# EAGLE schematic v6 (EAGLE 9.6.2)
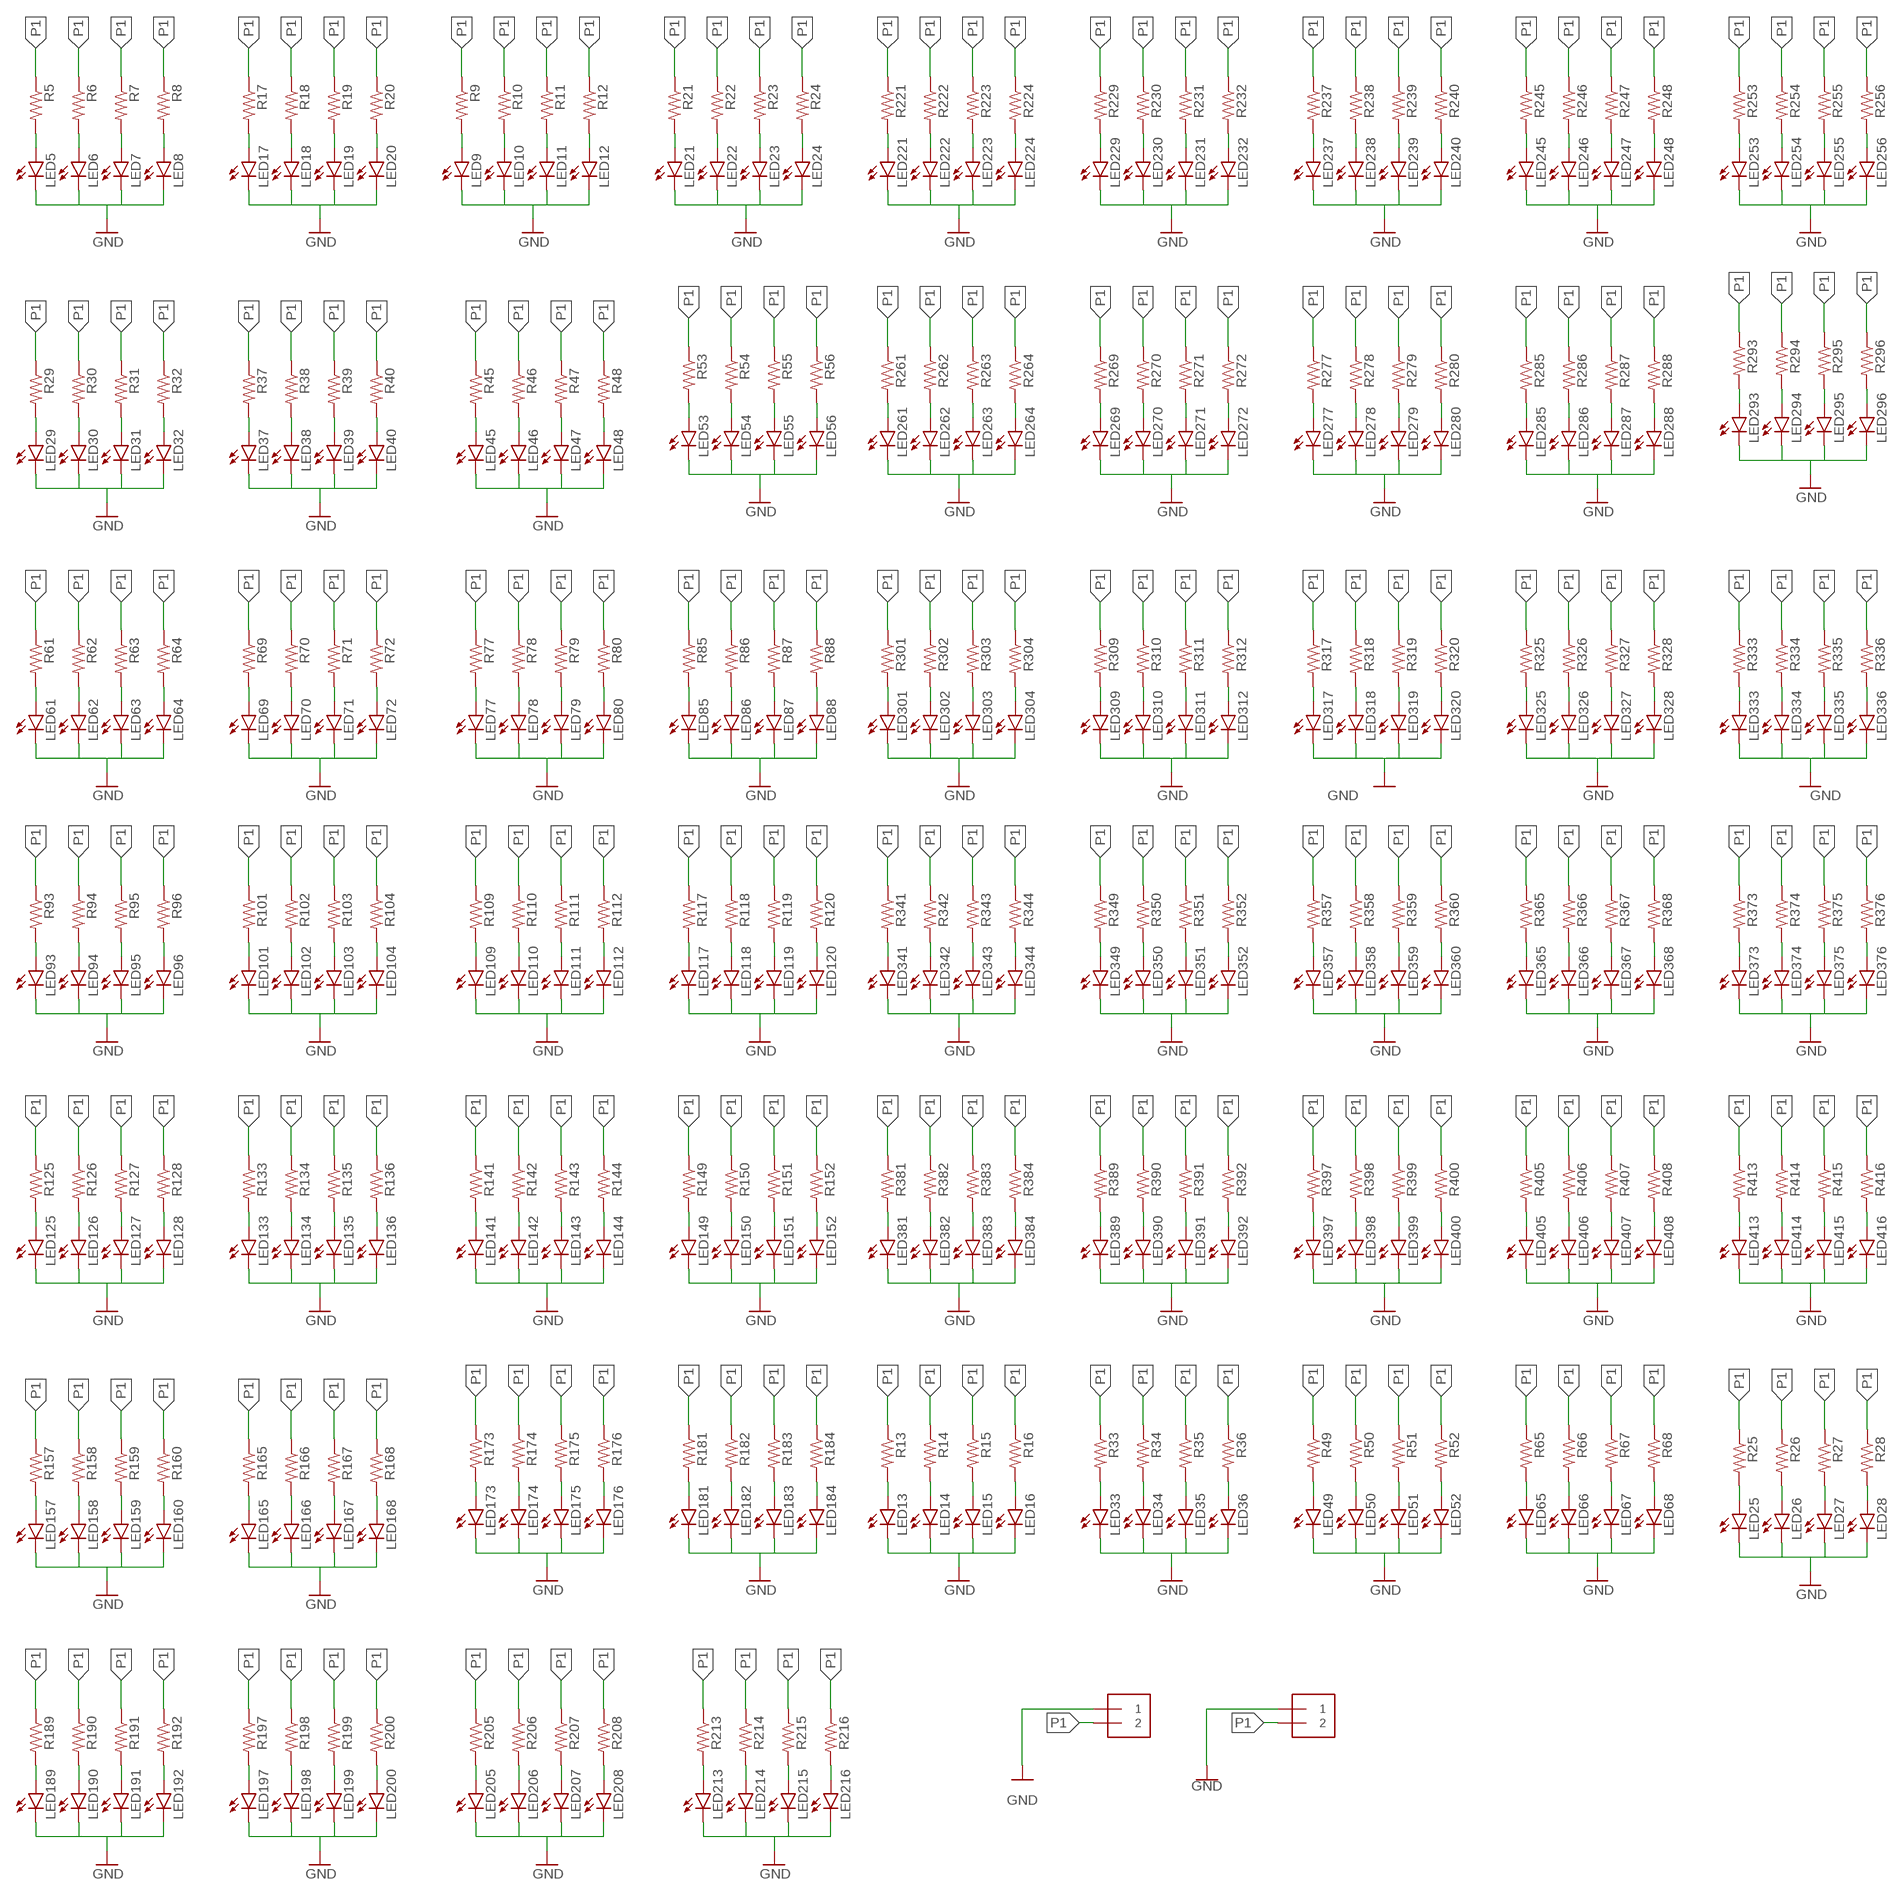
[diagram p0: schematic, sheet 1]

## Parts
LED5  LEDCHIP-LED0603  [CHIP-LED0603]
LED6  LEDCHIP-LED0603  [CHIP-LED0603]
LED7  LEDCHIP-LED0603  [CHIP-LED0603]
LED8  LEDCHIP-LED0603  [CHIP-LED0603]
LED9  LEDCHIP-LED0603  [CHIP-LED0603]
LED10  LEDCHIP-LED0603  [CHIP-LED0603]
LED11  LEDCHIP-LED0603  [CHIP-LED0603]
LED12  LEDCHIP-LED0603  [CHIP-LED0603]
LED13  LEDCHIP-LED0603  [CHIP-LED0603]
LED14  LEDCHIP-LED0603  [CHIP-LED0603]
LED15  LEDCHIP-LED0603  [CHIP-LED0603]
LED16  LEDCHIP-LED0603  [CHIP-LED0603]
LED17  LEDCHIP-LED0603  [CHIP-LED0603]
LED18  LEDCHIP-LED0603  [CHIP-LED0603]
LED19  LEDCHIP-LED0603  [CHIP-LED0603]
LED20  LEDCHIP-LED0603  [CHIP-LED0603]
LED21  LEDCHIP-LED0603  [CHIP-LED0603]
LED22  LEDCHIP-LED0603  [CHIP-LED0603]
LED23  LEDCHIP-LED0603  [CHIP-LED0603]
LED24  LEDCHIP-LED0603  [CHIP-LED0603]
LED25  LEDCHIP-LED0603  [CHIP-LED0603]
LED26  LEDCHIP-LED0603  [CHIP-LED0603]
LED27  LEDCHIP-LED0603  [CHIP-LED0603]
LED28  LEDCHIP-LED0603  [CHIP-LED0603]
LED29  LEDCHIP-LED0603  [CHIP-LED0603]
LED30  LEDCHIP-LED0603  [CHIP-LED0603]
LED31  LEDCHIP-LED0603  [CHIP-LED0603]
LED32  LEDCHIP-LED0603  [CHIP-LED0603]
LED33  LEDCHIP-LED0603  [CHIP-LED0603]
LED34  LEDCHIP-LED0603  [CHIP-LED0603]
LED35  LEDCHIP-LED0603  [CHIP-LED0603]
LED36  LEDCHIP-LED0603  [CHIP-LED0603]
LED37  LEDCHIP-LED0603  [CHIP-LED0603]
LED38  LEDCHIP-LED0603  [CHIP-LED0603]
LED39  LEDCHIP-LED0603  [CHIP-LED0603]
LED40  LEDCHIP-LED0603  [CHIP-LED0603]
LED45  LEDCHIP-LED0603  [CHIP-LED0603]
LED46  LEDCHIP-LED0603  [CHIP-LED0603]
LED47  LEDCHIP-LED0603  [CHIP-LED0603]
LED48  LEDCHIP-LED0603  [CHIP-LED0603]
LED49  LEDCHIP-LED0603  [CHIP-LED0603]
LED50  LEDCHIP-LED0603  [CHIP-LED0603]
LED51  LEDCHIP-LED0603  [CHIP-LED0603]
LED52  LEDCHIP-LED0603  [CHIP-LED0603]
LED53  LEDCHIP-LED0603  [CHIP-LED0603]
LED54  LEDCHIP-LED0603  [CHIP-LED0603]
LED55  LEDCHIP-LED0603  [CHIP-LED0603]
LED56  LEDCHIP-LED0603  [CHIP-LED0603]
LED61  LEDCHIP-LED0603  [CHIP-LED0603]
LED62  LEDCHIP-LED0603  [CHIP-LED0603]
LED63  LEDCHIP-LED0603  [CHIP-LED0603]
LED64  LEDCHIP-LED0603  [CHIP-LED0603]
LED65  LEDCHIP-LED0603  [CHIP-LED0603]
LED66  LEDCHIP-LED0603  [CHIP-LED0603]
LED67  LEDCHIP-LED0603  [CHIP-LED0603]
LED68  LEDCHIP-LED0603  [CHIP-LED0603]
LED69  LEDCHIP-LED0603  [CHIP-LED0603]
LED70  LEDCHIP-LED0603  [CHIP-LED0603]
LED71  LEDCHIP-LED0603  [CHIP-LED0603]
LED72  LEDCHIP-LED0603  [CHIP-LED0603]
LED77  LEDCHIP-LED0603  [CHIP-LED0603]
LED78  LEDCHIP-LED0603  [CHIP-LED0603]
LED79  LEDCHIP-LED0603  [CHIP-LED0603]
LED80  LEDCHIP-LED0603  [CHIP-LED0603]
LED85  LEDCHIP-LED0603  [CHIP-LED0603]
LED86  LEDCHIP-LED0603  [CHIP-LED0603]
LED87  LEDCHIP-LED0603  [CHIP-LED0603]
LED88  LEDCHIP-LED0603  [CHIP-LED0603]
LED93  LEDCHIP-LED0603  [CHIP-LED0603]
LED94  LEDCHIP-LED0603  [CHIP-LED0603]
LED95  LEDCHIP-LED0603  [CHIP-LED0603]
LED96  LEDCHIP-LED0603  [CHIP-LED0603]
LED101  LEDCHIP-LED0603  [CHIP-LED0603]
LED102  LEDCHIP-LED0603  [CHIP-LED0603]
LED103  LEDCHIP-LED0603  [CHIP-LED0603]
LED104  LEDCHIP-LED0603  [CHIP-LED0603]
LED109  LEDCHIP-LED0603  [CHIP-LED0603]
LED110  LEDCHIP-LED0603  [CHIP-LED0603]
LED111  LEDCHIP-LED0603  [CHIP-LED0603]
LED112  LEDCHIP-LED0603  [CHIP-LED0603]
LED117  LEDCHIP-LED0603  [CHIP-LED0603]
LED118  LEDCHIP-LED0603  [CHIP-LED0603]
LED119  LEDCHIP-LED0603  [CHIP-LED0603]
LED120  LEDCHIP-LED0603  [CHIP-LED0603]
LED125  LEDCHIP-LED0603  [CHIP-LED0603]
LED126  LEDCHIP-LED0603  [CHIP-LED0603]
LED127  LEDCHIP-LED0603  [CHIP-LED0603]
LED128  LEDCHIP-LED0603  [CHIP-LED0603]
LED133  LEDCHIP-LED0603  [CHIP-LED0603]
LED134  LEDCHIP-LED0603  [CHIP-LED0603]
LED135  LEDCHIP-LED0603  [CHIP-LED0603]
LED136  LEDCHIP-LED0603  [CHIP-LED0603]
LED141  LEDCHIP-LED0603  [CHIP-LED0603]
LED142  LEDCHIP-LED0603  [CHIP-LED0603]
LED143  LEDCHIP-LED0603  [CHIP-LED0603]
LED144  LEDCHIP-LED0603  [CHIP-LED0603]
LED149  LEDCHIP-LED0603  [CHIP-LED0603]
LED150  LEDCHIP-LED0603  [CHIP-LED0603]
LED151  LEDCHIP-LED0603  [CHIP-LED0603]
LED152  LEDCHIP-LED0603  [CHIP-LED0603]
LED157  LEDCHIP-LED0603  [CHIP-LED0603]
LED158  LEDCHIP-LED0603  [CHIP-LED0603]
LED159  LEDCHIP-LED0603  [CHIP-LED0603]
LED160  LEDCHIP-LED0603  [CHIP-LED0603]
LED165  LEDCHIP-LED0603  [CHIP-LED0603]
LED166  LEDCHIP-LED0603  [CHIP-LED0603]
LED167  LEDCHIP-LED0603  [CHIP-LED0603]
LED168  LEDCHIP-LED0603  [CHIP-LED0603]
LED173  LEDCHIP-LED0603  [CHIP-LED0603]
LED174  LEDCHIP-LED0603  [CHIP-LED0603]
LED175  LEDCHIP-LED0603  [CHIP-LED0603]
LED176  LEDCHIP-LED0603  [CHIP-LED0603]
LED181  LEDCHIP-LED0603  [CHIP-LED0603]
LED182  LEDCHIP-LED0603  [CHIP-LED0603]
LED183  LEDCHIP-LED0603  [CHIP-LED0603]
LED184  LEDCHIP-LED0603  [CHIP-LED0603]
LED189  LEDCHIP-LED0603  [CHIP-LED0603]
LED190  LEDCHIP-LED0603  [CHIP-LED0603]
LED191  LEDCHIP-LED0603  [CHIP-LED0603]
LED192  LEDCHIP-LED0603  [CHIP-LED0603]
LED197  LEDCHIP-LED0603  [CHIP-LED0603]
LED198  LEDCHIP-LED0603  [CHIP-LED0603]
LED199  LEDCHIP-LED0603  [CHIP-LED0603]
LED200  LEDCHIP-LED0603  [CHIP-LED0603]
LED205  LEDCHIP-LED0603  [CHIP-LED0603]
LED206  LEDCHIP-LED0603  [CHIP-LED0603]
LED207  LEDCHIP-LED0603  [CHIP-LED0603]
LED208  LEDCHIP-LED0603  [CHIP-LED0603]
LED213  LEDCHIP-LED0603  [CHIP-LED0603]
LED214  LEDCHIP-LED0603  [CHIP-LED0603]
LED215  LEDCHIP-LED0603  [CHIP-LED0603]
LED216  LEDCHIP-LED0603  [CHIP-LED0603]
LED221  LEDCHIP-LED0603  [CHIP-LED0603]
LED222  LEDCHIP-LED0603  [CHIP-LED0603]
LED223  LEDCHIP-LED0603  [CHIP-LED0603]
LED224  LEDCHIP-LED0603  [CHIP-LED0603]
LED229  LEDCHIP-LED0603  [CHIP-LED0603]
LED230  LEDCHIP-LED0603  [CHIP-LED0603]
LED231  LEDCHIP-LED0603  [CHIP-LED0603]
LED232  LEDCHIP-LED0603  [CHIP-LED0603]
LED237  LEDCHIP-LED0603  [CHIP-LED0603]
LED238  LEDCHIP-LED0603  [CHIP-LED0603]
LED239  LEDCHIP-LED0603  [CHIP-LED0603]
LED240  LEDCHIP-LED0603  [CHIP-LED0603]
LED245  LEDCHIP-LED0603  [CHIP-LED0603]
LED246  LEDCHIP-LED0603  [CHIP-LED0603]
LED247  LEDCHIP-LED0603  [CHIP-LED0603]
LED248  LEDCHIP-LED0603  [CHIP-LED0603]
LED253  LEDCHIP-LED0603  [CHIP-LED0603]
LED254  LEDCHIP-LED0603  [CHIP-LED0603]
LED255  LEDCHIP-LED0603  [CHIP-LED0603]
LED256  LEDCHIP-LED0603  [CHIP-LED0603]
LED261  LEDCHIP-LED0603  [CHIP-LED0603]
LED262  LEDCHIP-LED0603  [CHIP-LED0603]
LED263  LEDCHIP-LED0603  [CHIP-LED0603]
LED264  LEDCHIP-LED0603  [CHIP-LED0603]
LED269  LEDCHIP-LED0603  [CHIP-LED0603]
LED270  LEDCHIP-LED0603  [CHIP-LED0603]
LED271  LEDCHIP-LED0603  [CHIP-LED0603]
LED272  LEDCHIP-LED0603  [CHIP-LED0603]
LED277  LEDCHIP-LED0603  [CHIP-LED0603]
LED278  LEDCHIP-LED0603  [CHIP-LED0603]
LED279  LEDCHIP-LED0603  [CHIP-LED0603]
LED280  LEDCHIP-LED0603  [CHIP-LED0603]
LED285  LEDCHIP-LED0603  [CHIP-LED0603]
LED286  LEDCHIP-LED0603  [CHIP-LED0603]
LED287  LEDCHIP-LED0603  [CHIP-LED0603]
LED288  LEDCHIP-LED0603  [CHIP-LED0603]
LED293  LEDCHIP-LED0603  [CHIP-LED0603]
LED294  LEDCHIP-LED0603  [CHIP-LED0603]
LED295  LEDCHIP-LED0603  [CHIP-LED0603]
LED296  LEDCHIP-LED0603  [CHIP-LED0603]
LED301  LEDCHIP-LED0603  [CHIP-LED0603]
LED302  LEDCHIP-LED0603  [CHIP-LED0603]
LED303  LEDCHIP-LED0603  [CHIP-LED0603]
LED304  LEDCHIP-LED0603  [CHIP-LED0603]
LED309  LEDCHIP-LED0603  [CHIP-LED0603]
LED310  LEDCHIP-LED0603  [CHIP-LED0603]
LED311  LEDCHIP-LED0603  [CHIP-LED0603]
LED312  LEDCHIP-LED0603  [CHIP-LED0603]
LED317  LEDCHIP-LED0603  [CHIP-LED0603]
LED318  LEDCHIP-LED0603  [CHIP-LED0603]
LED319  LEDCHIP-LED0603  [CHIP-LED0603]
LED320  LEDCHIP-LED0603  [CHIP-LED0603]
LED325  LEDCHIP-LED0603  [CHIP-LED0603]
LED326  LEDCHIP-LED0603  [CHIP-LED0603]
LED327  LEDCHIP-LED0603  [CHIP-LED0603]
LED328  LEDCHIP-LED0603  [CHIP-LED0603]
LED333  LEDCHIP-LED0603  [CHIP-LED0603]
LED334  LEDCHIP-LED0603  [CHIP-LED0603]
LED335  LEDCHIP-LED0603  [CHIP-LED0603]
LED336  LEDCHIP-LED0603  [CHIP-LED0603]
LED341  LEDCHIP-LED0603  [CHIP-LED0603]
LED342  LEDCHIP-LED0603  [CHIP-LED0603]
LED343  LEDCHIP-LED0603  [CHIP-LED0603]
LED344  LEDCHIP-LED0603  [CHIP-LED0603]
LED349  LEDCHIP-LED0603  [CHIP-LED0603]
LED350  LEDCHIP-LED0603  [CHIP-LED0603]
LED351  LEDCHIP-LED0603  [CHIP-LED0603]
LED352  LEDCHIP-LED0603  [CHIP-LED0603]
LED357  LEDCHIP-LED0603  [CHIP-LED0603]
LED358  LEDCHIP-LED0603  [CHIP-LED0603]
LED359  LEDCHIP-LED0603  [CHIP-LED0603]
LED360  LEDCHIP-LED0603  [CHIP-LED0603]
LED365  LEDCHIP-LED0603  [CHIP-LED0603]
LED366  LEDCHIP-LED0603  [CHIP-LED0603]
LED367  LEDCHIP-LED0603  [CHIP-LED0603]
LED368  LEDCHIP-LED0603  [CHIP-LED0603]
LED373  LEDCHIP-LED0603  [CHIP-LED0603]
LED374  LEDCHIP-LED0603  [CHIP-LED0603]
LED375  LEDCHIP-LED0603  [CHIP-LED0603]
LED376  LEDCHIP-LED0603  [CHIP-LED0603]
LED381  LEDCHIP-LED0603  [CHIP-LED0603]
LED382  LEDCHIP-LED0603  [CHIP-LED0603]
LED383  LEDCHIP-LED0603  [CHIP-LED0603]
LED384  LEDCHIP-LED0603  [CHIP-LED0603]
LED389  LEDCHIP-LED0603  [CHIP-LED0603]
LED390  LEDCHIP-LED0603  [CHIP-LED0603]
LED391  LEDCHIP-LED0603  [CHIP-LED0603]
LED392  LEDCHIP-LED0603  [CHIP-LED0603]
LED397  LEDCHIP-LED0603  [CHIP-LED0603]
LED398  LEDCHIP-LED0603  [CHIP-LED0603]
LED399  LEDCHIP-LED0603  [CHIP-LED0603]
LED400  LEDCHIP-LED0603  [CHIP-LED0603]
LED405  LEDCHIP-LED0603  [CHIP-LED0603]
LED406  LEDCHIP-LED0603  [CHIP-LED0603]
LED407  LEDCHIP-LED0603  [CHIP-LED0603]
LED408  LEDCHIP-LED0603  [CHIP-LED0603]
LED413  LEDCHIP-LED0603  [CHIP-LED0603]
LED414  LEDCHIP-LED0603  [CHIP-LED0603]
LED415  LEDCHIP-LED0603  [CHIP-LED0603]
LED416  LEDCHIP-LED0603  [CHIP-LED0603]
R5  R-US_R0603  [R0603]
R6  R-US_R0603  [R0603]
R7  R-US_R0603  [R0603]
R8  R-US_R0603  [R0603]
R9  R-US_R0603  [R0603]
R10  R-US_R0603  [R0603]
R11  R-US_R0603  [R0603]
R12  R-US_R0603  [R0603]
R13  R-US_R0603  [R0603]
R14  R-US_R0603  [R0603]
R15  R-US_R0603  [R0603]
R16  R-US_R0603  [R0603]
R17  R-US_R0603  [R0603]
R18  R-US_R0603  [R0603]
R19  R-US_R0603  [R0603]
R20  R-US_R0603  [R0603]
R21  R-US_R0603  [R0603]
R22  R-US_R0603  [R0603]
R23  R-US_R0603  [R0603]
R24  R-US_R0603  [R0603]
R25  R-US_R0603  [R0603]
R26  R-US_R0603  [R0603]
R27  R-US_R0603  [R0603]
R28  R-US_R0603  [R0603]
R29  R-US_R0603  [R0603]
R30  R-US_R0603  [R0603]
R31  R-US_R0603  [R0603]
R32  R-US_R0603  [R0603]
R33  R-US_R0603  [R0603]
R34  R-US_R0603  [R0603]
R35  R-US_R0603  [R0603]
R36  R-US_R0603  [R0603]
R37  R-US_R0603  [R0603]
R38  R-US_R0603  [R0603]
R39  R-US_R0603  [R0603]
R40  R-US_R0603  [R0603]
R45  R-US_R0603  [R0603]
R46  R-US_R0603  [R0603]
R47  R-US_R0603  [R0603]
R48  R-US_R0603  [R0603]
R49  R-US_R0603  [R0603]
R50  R-US_R0603  [R0603]
R51  R-US_R0603  [R0603]
R52  R-US_R0603  [R0603]
R53  R-US_R0603  [R0603]
R54  R-US_R0603  [R0603]
R55  R-US_R0603  [R0603]
R56  R-US_R0603  [R0603]
R61  R-US_R0603  [R0603]
R62  R-US_R0603  [R0603]
R63  R-US_R0603  [R0603]
R64  R-US_R0603  [R0603]
R65  R-US_R0603  [R0603]
R66  R-US_R0603  [R0603]
R67  R-US_R0603  [R0603]
R68  R-US_R0603  [R0603]
R69  R-US_R0603  [R0603]
R70  R-US_R0603  [R0603]
R71  R-US_R0603  [R0603]
R72  R-US_R0603  [R0603]
R77  R-US_R0603  [R0603]
R78  R-US_R0603  [R0603]
R79  R-US_R0603  [R0603]
R80  R-US_R0603  [R0603]
R85  R-US_R0603  [R0603]
R86  R-US_R0603  [R0603]
R87  R-US_R0603  [R0603]
R88  R-US_R0603  [R0603]
R93  R-US_R0603  [R0603]
R94  R-US_R0603  [R0603]
R95  R-US_R0603  [R0603]
R96  R-US_R0603  [R0603]
R101  R-US_R0603  [R0603]
R102  R-US_R0603  [R0603]
R103  R-US_R0603  [R0603]
R104  R-US_R0603  [R0603]
R109  R-US_R0603  [R0603]
R110  R-US_R0603  [R0603]
R111  R-US_R0603  [R0603]
R112  R-US_R0603  [R0603]
R117  R-US_R0603  [R0603]
R118  R-US_R0603  [R0603]
R119  R-US_R0603  [R0603]
R120  R-US_R0603  [R0603]
R125  R-US_R0603  [R0603]
R126  R-US_R0603  [R0603]
R127  R-US_R0603  [R0603]
R128  R-US_R0603  [R0603]
R133  R-US_R0603  [R0603]
R134  R-US_R0603  [R0603]
R135  R-US_R0603  [R0603]
R136  R-US_R0603  [R0603]
R141  R-US_R0603  [R0603]
R142  R-US_R0603  [R0603]
R143  R-US_R0603  [R0603]
R144  R-US_R0603  [R0603]
R149  R-US_R0603  [R0603]
R150  R-US_R0603  [R0603]
R151  R-US_R0603  [R0603]
R152  R-US_R0603  [R0603]
R157  R-US_R0603  [R0603]
R158  R-US_R0603  [R0603]
R159  R-US_R0603  [R0603]
R160  R-US_R0603  [R0603]
R165  R-US_R0603  [R0603]
R166  R-US_R0603  [R0603]
R167  R-US_R0603  [R0603]
R168  R-US_R0603  [R0603]
R173  R-US_R0603  [R0603]
R174  R-US_R0603  [R0603]
R175  R-US_R0603  [R0603]
R176  R-US_R0603  [R0603]
R181  R-US_R0603  [R0603]
R182  R-US_R0603  [R0603]
R183  R-US_R0603  [R0603]
R184  R-US_R0603  [R0603]
R189  R-US_R0603  [R0603]
R190  R-US_R0603  [R0603]
R191  R-US_R0603  [R0603]
R192  R-US_R0603  [R0603]
R197  R-US_R0603  [R0603]
R198  R-US_R0603  [R0603]
R199  R-US_R0603  [R0603]
R200  R-US_R0603  [R0603]
R205  R-US_R0603  [R0603]
R206  R-US_R0603  [R0603]
R207  R-US_R0603  [R0603]
R208  R-US_R0603  [R0603]
R213  R-US_R0603  [R0603]
R214  R-US_R0603  [R0603]
R215  R-US_R0603  [R0603]
R216  R-US_R0603  [R0603]
R221  R-US_R0603  [R0603]
R222  R-US_R0603  [R0603]
R223  R-US_R0603  [R0603]
R224  R-US_R0603  [R0603]
R229  R-US_R0603  [R0603]
R230  R-US_R0603  [R0603]
R231  R-US_R0603  [R0603]
R232  R-US_R0603  [R0603]
R237  R-US_R0603  [R0603]
R238  R-US_R0603  [R0603]
R239  R-US_R0603  [R0603]
R240  R-US_R0603  [R0603]
R245  R-US_R0603  [R0603]
R246  R-US_R0603  [R0603]
R247  R-US_R0603  [R0603]
R248  R-US_R0603  [R0603]
R253  R-US_R0603  [R0603]
R254  R-US_R0603  [R0603]
R255  R-US_R0603  [R0603]
R256  R-US_R0603  [R0603]
R261  R-US_R0603  [R0603]
R262  R-US_R0603  [R0603]
R263  R-US_R0603  [R0603]
R264  R-US_R0603  [R0603]
R269  R-US_R0603  [R0603]
R270  R-US_R0603  [R0603]
R271  R-US_R0603  [R0603]
R272  R-US_R0603  [R0603]
R277  R-US_R0603  [R0603]
R278  R-US_R0603  [R0603]
R279  R-US_R0603  [R0603]
R280  R-US_R0603  [R0603]
R285  R-US_R0603  [R0603]
R286  R-US_R0603  [R0603]
R287  R-US_R0603  [R0603]
R288  R-US_R0603  [R0603]
R293  R-US_R0603  [R0603]
R294  R-US_R0603  [R0603]
R295  R-US_R0603  [R0603]
R296  R-US_R0603  [R0603]
R301  R-US_R0603  [R0603]
R302  R-US_R0603  [R0603]
R303  R-US_R0603  [R0603]
R304  R-US_R0603  [R0603]
R309  R-US_R0603  [R0603]
R310  R-US_R0603  [R0603]
R311  R-US_R0603  [R0603]
R312  R-US_R0603  [R0603]
R317  R-US_R0603  [R0603]
R318  R-US_R0603  [R0603]
R319  R-US_R0603  [R0603]
R320  R-US_R0603  [R0603]
R325  R-US_R0603  [R0603]
R326  R-US_R0603  [R0603]
R327  R-US_R0603  [R0603]
R328  R-US_R0603  [R0603]
R333  R-US_R0603  [R0603]
R334  R-US_R0603  [R0603]
R335  R-US_R0603  [R0603]
R336  R-US_R0603  [R0603]
R341  R-US_R0603  [R0603]
R342  R-US_R0603  [R0603]
R343  R-US_R0603  [R0603]
R344  R-US_R0603  [R0603]
R349  R-US_R0603  [R0603]
R350  R-US_R0603  [R0603]
R351  R-US_R0603  [R0603]
R352  R-US_R0603  [R0603]
R357  R-US_R0603  [R0603]
R358  R-US_R0603  [R0603]
R359  R-US_R0603  [R0603]
R360  R-US_R0603  [R0603]
R365  R-US_R0603  [R0603]
R366  R-US_R0603  [R0603]
R367  R-US_R0603  [R0603]
R368  R-US_R0603  [R0603]
R373  R-US_R0603  [R0603]
R374  R-US_R0603  [R0603]
R375  R-US_R0603  [R0603]
R376  R-US_R0603  [R0603]
R381  R-US_R0603  [R0603]
R382  R-US_R0603  [R0603]
R383  R-US_R0603  [R0603]
R384  R-US_R0603  [R0603]
R389  R-US_R0603  [R0603]
R390  R-US_R0603  [R0603]
R391  R-US_R0603  [R0603]
R392  R-US_R0603  [R0603]
R397  R-US_R0603  [R0603]
R398  R-US_R0603  [R0603]
R399  R-US_R0603  [R0603]
R400  R-US_R0603  [R0603]
R405  R-US_R0603  [R0603]
R406  R-US_R0603  [R0603]
R407  R-US_R0603  [R0603]
R408  R-US_R0603  [R0603]
R413  R-US_R0603  [R0603]
R414  R-US_R0603  [R0603]
R415  R-US_R0603  [R0603]
R416  R-US_R0603  [R0603]
U$1  MOLEX_0039301022  [MINI-FIT_JR_CONN]
U$2  MOLEX_0039301022  [MINI-FIT_JR_CONN]

## Nets
GNDSSS: LED5.C LED6.C LED7.C LED8.C LED9.C LED10.C LED11.C LED12.C LED13.C LED14.C LED15.C LED16.C LED17.C LED18.C LED19.C LED20.C LED21.C LED22.C LED23.C LED24.C LED25.C LED26.C LED27.C LED28.C LED29.C LED30.C LED31.C LED32.C LED33.C LED34.C LED35.C LED36.C LED37.C LED38.C LED39.C LED40.C LED45.C LED46.C LED47.C LED48.C LED49.C LED50.C LED51.C LED52.C LED53.C LED54.C LED55.C LED56.C LED61.C LED62.C LED63.C LED64.C LED65.C LED66.C LED67.C LED68.C LED69.C LED70.C LED71.C LED72.C LED77.C LED78.C LED79.C LED80.C LED85.C LED86.C LED87.C LED88.C LED93.C LED94.C LED95.C LED96.C LED101.C LED102.C LED103.C LED104.C LED109.C LED110.C LED111.C LED112.C LED117.C LED118.C LED119.C LED120.C LED125.C LED126.C LED127.C LED128.C LED133.C LED134.C LED135.C LED136.C LED141.C LED142.C LED143.C LED144.C LED149.C LED150.C LED151.C LED152.C LED157.C LED158.C LED159.C LED160.C LED165.C LED166.C LED167.C LED168.C LED173.C LED174.C LED175.C LED176.C LED181.C LED182.C LED183.C LED184.C LED189.C LED190.C LED191.C LED192.C LED197.C LED198.C LED199.C LED200.C LED205.C LED206.C LED207.C LED208.C LED213.C LED214.C LED215.C LED216.C LED221.C LED222.C LED223.C LED224.C LED229.C LED230.C LED231.C LED232.C LED237.C LED238.C LED239.C LED240.C LED245.C LED246.C LED247.C LED248.C LED253.C LED254.C LED255.C LED256.C LED261.C LED262.C LED263.C LED264.C LED269.C LED270.C LED271.C LED272.C LED277.C LED278.C LED279.C LED280.C LED285.C LED286.C LED287.C LED288.C LED293.C LED294.C LED295.C LED296.C LED301.C LED302.C LED303.C LED304.C LED309.C LED310.C LED311.C LED312.C LED317.C LED318.C LED319.C LED320.C LED325.C LED326.C LED327.C LED328.C LED333.C LED334.C LED335.C LED336.C LED341.C LED342.C LED343.C LED344.C LED349.C LED350.C LED351.C LED352.C LED357.C LED358.C LED359.C LED360.C LED365.C LED366.C LED367.C LED368.C LED373.C LED374.C LED375.C LED376.C LED381.C LED382.C LED383.C LED384.C LED389.C LED390.C LED391.C LED392.C LED397.C LED398.C LED399.C LED400.C LED405.C LED406.C LED407.C LED408.C LED413.C LED414.C LED415.C LED416.C U$1.P$2 U$2.P$2 ; supply symbol labelled GND
N$1: LED5.A R5.2
N$2: LED6.A R6.2
N$3: LED7.A R7.2
N$4: LED8.A R8.2
N$5: LED9.A R9.2
N$6: LED10.A R10.2
N$7: LED11.A R11.2
N$8: LED12.A R12.2
N$9: LED13.A R13.2
N$10: LED14.A R14.2
N$11: LED15.A R15.2
N$12: LED16.A R16.2
N$13: LED17.A R17.2
N$14: LED18.A R18.2
N$15: LED19.A R19.2
N$16: LED20.A R20.2
N$17: LED21.A R21.2
N$18: LED22.A R22.2
N$19: LED23.A R23.2
N$20: LED24.A R24.2
N$21: LED25.A R25.2
N$22: LED26.A R26.2
N$23: LED27.A R27.2
N$24: LED28.A R28.2
N$29: LED29.A R29.2
N$30: LED30.A R30.2
N$31: LED31.A R31.2
N$32: LED32.A R32.2
N$33: LED33.A R33.2
N$34: LED34.A R34.2
N$35: LED35.A R35.2
N$36: LED36.A R36.2
N$37: LED37.A R37.2
N$38: LED38.A R38.2
N$39: LED39.A R39.2
N$40: LED40.A R40.2
N$45: LED45.A R45.2
N$46: LED46.A R46.2
N$47: LED47.A R47.2
N$48: LED48.A R48.2
N$49: LED49.A R49.2
N$50: LED50.A R50.2
N$51: LED51.A R51.2
N$52: LED52.A R52.2
N$53: LED53.A R53.2
N$54: LED54.A R54.2
N$55: LED55.A R55.2
N$56: LED56.A R56.2
N$61: LED61.A R61.2
N$62: LED62.A R62.2
N$63: LED63.A R63.2
N$64: LED64.A R64.2
N$65: LED65.A R65.2
N$66: LED66.A R66.2
N$67: LED67.A R67.2
N$68: LED68.A R68.2
N$69: LED69.A R69.2
N$70: LED70.A R70.2
N$71: LED71.A R71.2
N$72: LED72.A R72.2
N$77: LED77.A R77.2
N$78: LED78.A R78.2
N$79: LED79.A R79.2
N$80: LED80.A R80.2
N$85: LED85.A R85.2
N$86: LED86.A R86.2
N$87: LED87.A R87.2
N$88: LED88.A R88.2
N$93: LED93.A R93.2
N$94: LED94.A R94.2
N$95: LED95.A R95.2
N$96: LED96.A R96.2
N$101: LED101.A R101.2
N$102: LED102.A R102.2
N$103: LED103.A R103.2
N$104: LED104.A R104.2
N$109: LED109.A R109.2
N$110: LED110.A R110.2
N$111: LED111.A R111.2
N$112: LED112.A R112.2
N$117: LED117.A R117.2
N$118: LED118.A R118.2
N$119: LED119.A R119.2
N$120: LED120.A R120.2
N$125: LED125.A R125.2
N$126: LED126.A R126.2
N$127: LED127.A R127.2
N$128: LED128.A R128.2
N$133: LED133.A R133.2
N$134: LED134.A R134.2
N$135: LED135.A R135.2
N$136: LED136.A R136.2
N$141: LED141.A R141.2
N$142: LED142.A R142.2
N$143: LED143.A R143.2
N$144: LED144.A R144.2
N$149: LED149.A R149.2
N$150: LED150.A R150.2
N$151: LED151.A R151.2
N$152: LED152.A R152.2
N$157: LED157.A R157.2
N$158: LED158.A R158.2
N$159: LED159.A R159.2
N$160: LED160.A R160.2
N$165: LED165.A R165.2
N$166: LED166.A R166.2
N$167: LED167.A R167.2
N$168: LED168.A R168.2
N$173: LED173.A R173.2
N$174: LED174.A R174.2
N$175: LED175.A R175.2
N$176: LED176.A R176.2
N$181: LED181.A R181.2
N$182: LED182.A R182.2
N$183: LED183.A R183.2
N$184: LED184.A R184.2
N$189: LED189.A R189.2
N$190: LED190.A R190.2
N$191: LED191.A R191.2
N$192: LED192.A R192.2
N$197: LED197.A R197.2
N$198: LED198.A R198.2
N$199: LED199.A R199.2
N$200: LED200.A R200.2
N$205: LED205.A R205.2
N$206: LED206.A R206.2
N$207: LED207.A R207.2
N$208: LED208.A R208.2
N$213: LED213.A R213.2
N$214: LED214.A R214.2
N$215: LED215.A R215.2
N$216: LED216.A R216.2
N$221: LED221.A R221.2
N$222: LED222.A R222.2
N$223: LED223.A R223.2
N$224: LED224.A R224.2
N$229: LED229.A R229.2
N$230: LED230.A R230.2
N$231: LED231.A R231.2
N$232: LED232.A R232.2
N$237: LED237.A R237.2
N$238: LED238.A R238.2
N$239: LED239.A R239.2
N$240: LED240.A R240.2
N$245: LED245.A R245.2
N$246: LED246.A R246.2
N$247: LED247.A R247.2
N$248: LED248.A R248.2
N$253: LED253.A R253.2
N$254: LED254.A R254.2
N$255: LED255.A R255.2
N$256: LED256.A R256.2
N$261: LED261.A R261.2
N$262: LED262.A R262.2
N$263: LED263.A R263.2
N$264: LED264.A R264.2
N$269: LED269.A R269.2
N$270: LED270.A R270.2
N$271: LED271.A R271.2
N$272: LED272.A R272.2
N$277: LED277.A R277.2
N$278: LED278.A R278.2
N$279: LED279.A R279.2
N$280: LED280.A R280.2
N$285: LED285.A R285.2
N$286: LED286.A R286.2
N$287: LED287.A R287.2
N$288: LED288.A R288.2
N$293: LED293.A R293.2
N$294: LED294.A R294.2
N$295: LED295.A R295.2
N$296: LED296.A R296.2
N$301: LED301.A R301.2
N$302: LED302.A R302.2
N$303: LED303.A R303.2
N$304: LED304.A R304.2
N$309: LED309.A R309.2
N$310: LED310.A R310.2
N$311: LED311.A R311.2
N$312: LED312.A R312.2
N$317: LED317.A R317.2
N$318: LED318.A R318.2
N$319: LED319.A R319.2
N$320: LED320.A R320.2
N$325: LED325.A R325.2
N$326: LED326.A R326.2
N$327: LED327.A R327.2
N$328: LED328.A R328.2
N$333: LED333.A R333.2
N$334: LED334.A R334.2
N$335: LED335.A R335.2
N$336: LED336.A R336.2
N$341: LED341.A R341.2
N$342: LED342.A R342.2
N$343: LED343.A R343.2
N$344: LED344.A R344.2
N$349: LED349.A R349.2
N$350: LED350.A R350.2
N$351: LED351.A R351.2
N$352: LED352.A R352.2
N$357: LED357.A R357.2
N$358: LED358.A R358.2
N$359: LED359.A R359.2
N$360: LED360.A R360.2
N$365: LED365.A R365.2
N$366: LED366.A R366.2
N$367: LED367.A R367.2
N$368: LED368.A R368.2
N$373: LED373.A R373.2
N$374: LED374.A R374.2
N$375: LED375.A R375.2
N$376: LED376.A R376.2
N$381: LED381.A R381.2
N$382: LED382.A R382.2
N$383: LED383.A R383.2
N$384: LED384.A R384.2
N$389: LED389.A R389.2
N$390: LED390.A R390.2
N$391: LED391.A R391.2
N$392: LED392.A R392.2
N$397: LED397.A R397.2
N$398: LED398.A R398.2
N$399: LED399.A R399.2
N$400: LED400.A R400.2
N$405: LED405.A R405.2
N$406: LED406.A R406.2
N$407: LED407.A R407.2
N$408: LED408.A R408.2
N$413: LED413.A R413.2
N$414: LED414.A R414.2
N$415: LED415.A R415.2
N$416: LED416.A R416.2
P1: R5.1 R6.1 R7.1 R8.1 R9.1 R10.1 R11.1 R12.1 R13.1 R14.1 R15.1 R16.1 R17.1 R18.1 R19.1 R20.1 R21.1 R22.1 R23.1 R24.1 R25.1 R26.1 R27.1 R28.1 R29.1 R30.1 R31.1 R32.1 R33.1 R34.1 R35.1 R36.1 R37.1 R38.1 R39.1 R40.1 R45.1 R46.1 R47.1 R48.1 R49.1 R50.1 R51.1 R52.1 R53.1 R54.1 R55.1 R56.1 R61.1 R62.1 R63.1 R64.1 R65.1 R66.1 R67.1 R68.1 R69.1 R70.1 R71.1 R72.1 R77.1 R78.1 R79.1 R80.1 R85.1 R86.1 R87.1 R88.1 R93.1 R94.1 R95.1 R96.1 R101.1 R102.1 R103.1 R104.1 R109.1 R110.1 R111.1 R112.1 R117.1 R118.1 R119.1 R120.1 R125.1 R126.1 R127.1 R128.1 R133.1 R134.1 R135.1 R136.1 R141.1 R142.1 R143.1 R144.1 R149.1 R150.1 R151.1 R152.1 R157.1 R158.1 R159.1 R160.1 R165.1 R166.1 R167.1 R168.1 R173.1 R174.1 R175.1 R176.1 R181.1 R182.1 R183.1 R184.1 R189.1 R190.1 R191.1 R192.1 R197.1 R198.1 R199.1 R200.1 R205.1 R206.1 R207.1 R208.1 R213.1 R214.1 R215.1 R216.1 R221.1 R222.1 R223.1 R224.1 R229.1 R230.1 R231.1 R232.1 R237.1 R238.1 R239.1 R240.1 R245.1 R246.1 R247.1 R248.1 R253.1 R254.1 R255.1 R256.1 R261.1 R262.1 R263.1 R264.1 R269.1 R270.1 R271.1 R272.1 R277.1 R278.1 R279.1 R280.1 R285.1 R286.1 R287.1 R288.1 R293.1 R294.1 R295.1 R296.1 R301.1 R302.1 R303.1 R304.1 R309.1 R310.1 R311.1 R312.1 R317.1 R318.1 R319.1 R320.1 R325.1 R326.1 R327.1 R328.1 R333.1 R334.1 R335.1 R336.1 R341.1 R342.1 R343.1 R344.1 R349.1 R350.1 R351.1 R352.1 R357.1 R358.1 R359.1 R360.1 R365.1 R366.1 R367.1 R368.1 R373.1 R374.1 R375.1 R376.1 R381.1 R382.1 R383.1 R384.1 R389.1 R390.1 R391.1 R392.1 R397.1 R398.1 R399.1 R400.1 R405.1 R406.1 R407.1 R408.1 R413.1 R414.1 R415.1 R416.1 U$1.P$1 U$2.P$1

## Library data of the parts
LED5-LED40 LED45-LED56 LED61-LED72 LED77-LED80 LED85-LED88 LED93-LED96 LED101-LED104 LED109-LED112 LED117-LED120 LED125-LED128 LED133-LED136 LED141-LED144 LED149-LED152 LED157-LED160 LED165-LED168 LED173-LED176 LED181-LED184 LED189-LED192 LED197-LED200 LED205-LED208 LED213-LED216 LED221-LED224 LED229-LED232 LED237-LED240 LED245-LED248 LED253-LED256 LED261-LED264 LED269-LED272 LED277-LED280 LED285-LED288 LED293-LED296 LED301-LED304 LED309-LED312 LED317-LED320 LED325-LED328 LED333-LED336 LED341-LED344 LED349-LED352 LED357-LED360 LED365-LED368 LED373-LED376 LED381-LED384 LED389-LED392 LED397-LED400 LED405-LED408 LED413-LED416 = led:LED: LED OSRAM: - CHIPLED LG R971, LG N971, LY N971, LG Q971, LY Q971, LO R971, LY R971 LH N974, LH R974 LS Q976, LO Q976, LY Q976 LO Q996 - Hyper CHIPLED LW Q18S LB Q993, LB Q99A, LB R99A - SideLED LS A670, LO A670, LY A670, LG A670, LP A670 LB A673, LV A673, LT A673, LW A673 LH A674 LY A675 LS A676, LA A676, LO A676, LY A676, LW A676 LS A679, LY A679, LG A679 - Hyper Micro SIDELED® LS Y876, LA Y876, LO Y876, LY Y876 LT Y87S - SmartLED LW L88C, LW L88S LB L89C, LB L89S, LG L890 LS L89K, LO L89K, LY L89K LS L896, LA L896, LO L896, LY L896 - TOPLED LS T670, LO T670, LY T670, LG T670, LP T670 LSG T670, LSP T670, LSY T670, LOP T670, LYG T670 LG T671, LOG T671, LSG T671 LB T673, LV T673, LT T673, LW T673 LH T674 LS T676, LA T676, LO T676, LY T676, LB T676, LH T676, LSB T676, LW T676 LB T67C, LV T67C, LT T67C, LS T67K, LO T67K, LY T67K, LW E67C LS E67B, LA E67B, LO E67B, LY E67B, LB E67C, LV E67C, LT E67C LW T67C LS T679, LY T679, LG T679 LS T770, LO T770, LY T770, LG T770, LP T770 LB T773, LV T773, LT T773, LW T773 LH T774 LS E675, LA E675, LY E675, LS T675 LS T776, LA T776, LO T776, LY T776, LB T776 LHGB T686 LT T68C, LB T68C - Hyper Mini TOPLED® LB M676 - Mini TOPLED Santana® LG M470 LS M47K, LO M47K, LY M47K Source: http://www.osram.convergy.de LUXEON: - LUMILED® LXK2-PW12-R00, LXK2-PW12-S00, LXK2-PW14-U00, LXK2-PW14-V00 LXK2-PM12-R00, LXK2-PM12-S00, LXK2-PM14-U00 LXK2-PE12-Q00, LXK2-PE12-R00, LXK2-PE12-S00, LXK2-PE14-T00, LXK2-PE14-U00 LXK2-PB12-K00, LXK2-PB12-L00, LXK2-PB12-M00, LXK2-PB14-N00, LXK2-PB14-P00, LXK2-PB14-Q00 LXK2-PR12-L00, LXK2-PR12-M00, LXK2-PR14-Q00, LXK2-PR14-R00 LXK2-PD12-Q00, LXK2-PD12-R00, LXK2-PD12-S00 LXK2-PH12-R00, LXK2-PH12-S00 LXK2-PL12-P00, LXK2-PL12-Q00, LXK2-PL12-R00 Source: www.luxeon.com KINGBRIGHT: KA-3528ASYC Source: www.kingbright.com
R5-R40 R45-R56 R61-R72 R77-R80 R85-R88 R93-R96 R101-R104 R109-R112 R117-R120 R125-R128 R133-R136 R141-R144 R149-R152 R157-R160 R165-R168 R173-R176 R181-R184 R189-R192 R197-R200 R205-R208 R213-R216 R221-R224 R229-R232 R237-R240 R245-R248 R253-R256 R261-R264 R269-R272 R277-R280 R285-R288 R293-R296 R301-R304 R309-R312 R317-R320 R325-R328 R333-R336 R341-R344 R349-R352 R357-R360 R365-R368 R373-R376 R381-R384 R389-R392 R397-R400 R405-R408 R413-R416 = adafruit:R-US_: RESISTOR, American symbol
U$1 U$2 = pat:MOLEX_0039301022